# EAGLE design 89c2051-mac-ps2 (EAGLE 4.16)
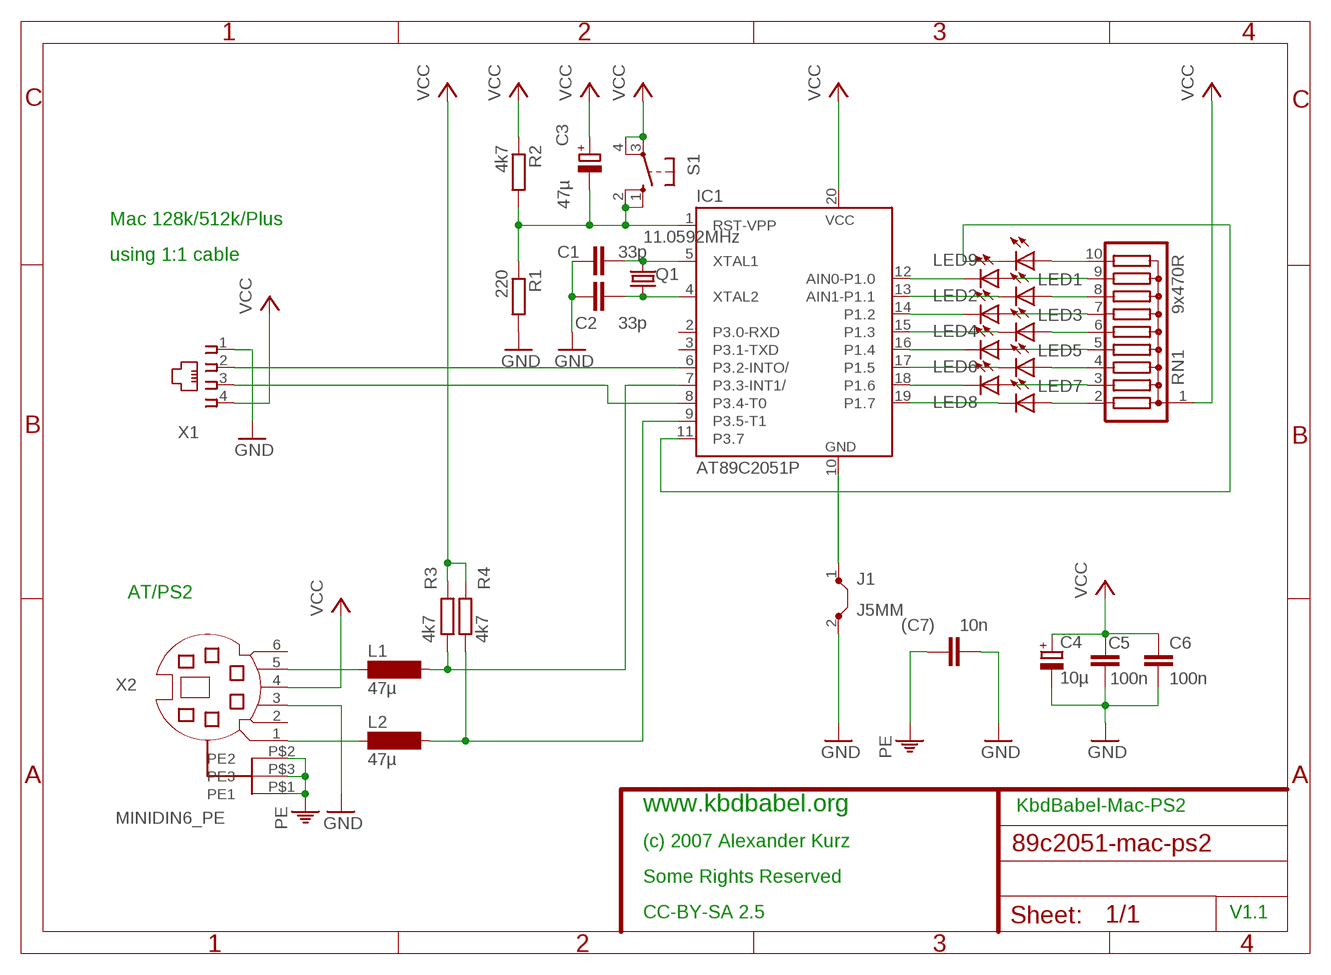
[diagram p0: schematic, sheet 1]

## Parts
(C7)  10n  C-EU025_050-025X075  [C025_050-025X075]
C1  33p  C-EU025-030X050  [C025-030X050]
C2  33p  C-EU025-030X050  [C025-030X050]
C3  47µ  CPOL-EUE2-5  [E2-5]
C4  10µ  CPOL-EUE2-5  [E2-5]
C5  100n  C-EU025_050-025X075  [C025_050-025X075]
C6  100n  C-EU025_050-025X075  [C025_050-025X075]
IC1  AT89C2051P  [DIL20]
J1  J5MM  [05]
L1  47µ  SD75  [SD75]
L2  47µ  SD75  [SD75]
LED1  LEDSQR2X5  [LED2X5]
LED2  LEDSQR2X5  [LED2X5]
LED3  LEDSQR2X5  [LED2X5]
LED4  LEDSQR2X5  [LED2X5]
LED5  LEDSQR2X5  [LED2X5]
LED6  LEDSQR2X5  [LED2X5]
LED7  LEDSQR2X5  [LED2X5]
LED8  LEDSQR2X5  [LED2X5]
LED9  LEDSQR2X5  [LED2X5]
Q1  11.0592MHz  CRYSTALHC49U70  [HC49U70]
R1  220  R-EU_0204/7  [0204/7]
R2  4k7  R-EU_0204/7  [0204/7]
R3  4k7  R-EU_0204/7  [0204/7]
R4  4k7  R-EU_0204/7  [0204/7]
RN1  9x470R  G09R  [SIL10]
S1  10-XX  [B3F-10XX]
X1  520249-2  [520249-2]
X2  MINIDIN6_PE  [MINIDIN6_PE]

## Nets
GND: (C7).2 C1.1 C2.2 C4.- C5.1 C6.2 J1.2 R1.2 X1.1 X2.3
N$1: C1.2 IC1.5(XTAL1) Q1.2
N$2: C2.1 IC1.4(XTAL2) Q1.1
N$3: IC1.10(GND) J1.1
N$4: LED4.A RN1.6
N$5: LED8.A RN1.2
N$6: L1.1 X2.5
N$7: IC1.6(P3.2-INTO/) X1.2
N$8: LED7.A RN1.3
N$9: C3.- IC1.1(RST-VPP) R1.1 R2.2 S1.1(S) S1.2(S1)
N$10: IC1.8(P3.4-T0) X1.3
N$11: LED6.A RN1.4
N$12: IC1.9(P3.5-T1) L2.2 R4.2
N$13: LED5.A RN1.5
N$14: LED3.A RN1.7
N$15: LED2.A RN1.8
N$16: LED1.A RN1.9
N$17: LED9.A RN1.10
N$18: IC1.12(AIN0-P1.0) LED1.K(C)
N$19: IC1.13(AIN1-P1.1) LED2.K(C)
N$20: IC1.14(P1.2) LED3.K(C)
N$21: IC1.15(P1.3) LED4.K(C)
N$22: IC1.16(P1.4) LED5.K(C)
N$23: IC1.17(P1.5) LED6.K(C)
N$24: IC1.18(P1.6) LED7.K(C)
N$25: IC1.19(P1.7) LED8.K(C)
N$26: L2.1 X2.1
N$28: IC1.11(P3.7) LED9.K(C)
N$30: IC1.7(P3.3-INT1/) L1.2 R3.2
PE: (C7).1 X2.P$1(PE1) X2.P$2(PE2) X2.P$3(PE3)
VCC: C3.+ C4.+ C5.2 C6.1 IC1.20(VCC) R2.1 R3.1 R4.1 RN1.1 S1.3(P) S1.4(P1) X1.4 X2.4
Unconnected: IC1.2(P3.0-RXD) IC1.3(P3.1-TXD) X2.2 X2.6

## Notes on the sheet
- Mac 128k/512k/Plus
- using 1:1 cable
- AT/PS2
- www.kbdbabel.org | KbdBabel-Mac-PS2
- (c) 2007 Alexander Kurz
- Some Rights Reserved
- CC-BY-SA 2.5 | V1.1

## Library data of the parts
(C7) C1 C2 C5 C6 = rcl:C-EU: CAPACITOR, European symbol
C3 C4 = rcl:CPOL-EU: POLARIZED CAPACITOR, European symbol
IC1 = atmel:AT89C2051: 80C31 MICROCONTROLLER 2 Kbytes FLASH 2.7 V
J1 = jumper:J: Bridge
L1 L2 = inductor-neosid:SD75: INDUCTOR nominal inductance, E12
LED1-LED9 = led:LED: LED OSRAM: - CHIPLED LG R971, LG N971, LY N971, LG Q971, LY Q971, LO R971, LY R971 LH N974, LH R974 LS Q976, LO Q976, LY Q976 LO Q996 - Hyper CHIPLED LW Q18S LB Q993, LB Q99A, LB R99A - SideLED LS A670, LO A670, LY A670, LG A670, LP A670 LB A673, LV A673, LT A673, LW A673 LH A674 LY A675 LS A676, LA A676, LO A676, LY A676, LW A676 LS A679, LY A679, LG A679 - Hyper Micro SIDELED® LS Y876, LA Y876, LO Y876, LY Y876 LT Y87S - SmartLED LW L88C, LW L88S LB L89C, LB L89S, LG L890 LS L89K, LO L89K, LY L89K LS L896, LA L896, LO L896, LY L896 - TOPLED LS T670, LO T670, LY T670, LG T670, LP T670 LSG T670, LSP T670, LSY T670, LOP T670, LYG T670 LG T671, LOG T671, LSG T671 LB T673, LV T673, LT T673, LW T673 LH T674 LS T676, LA T676, LO T676, LY T676, LB T676, LH T676, LSB T676, LW T676 LB T67C, LV T67C, LT T67C, LS T67K, LO T67K, LY T67K, LW E67C LS E67B, LA E67B, LO E67B, LY E67B, LB E67C, LV E67C, LT E67C LW T67C LS T679, LY T679, LG T679 LS T770, LO T770, LY T770, LG T770, LP T770 LB T773, LV T773, LT T773, LW T773 LH T774 LS E675, LA E675, LY E675, LS T675 LS T776, LA T776, LO T776, LY T776, LB T776 LHGB T686 LT T68C, LB T68C - Hyper Mini TOPLED® LB M676 - Mini TOPLED Santana® LG M470 LS M47K, LO M47K, LY M47K Source: http://www.osram.convergy.de - LUMILED® LXK2-PW12-R00, LXK2-PW12-S00, LXK2-PW14-U00, LXK2-PW14-V00 LXK2-PM12-R00, LXK2-PM12-S00, LXK2-PM14-U00 LXK2-PE12-Q00, LXK2-PE12-R00, LXK2-PE12-S00, LXK2-PE14-T00, LXK2-PE14-U00 LXK2-PB12-K00, LXK2-PB12-L00, LXK2-PB12-M00, LXK2-PB14-N00, LXK2-PB14-P00, LXK2-PB14-Q00 LXK2-PR12-L00, LXK2-PR12-M00, LXK2-PR14-Q00, LXK2-PR14-R00 LXK2-PD12-Q00, LXK2-PD12-R00, LXK2-PD12-S00 LXK2-PH12-R00, LXK2-PH12-S00 LXK2-PL12-P00, LXK2-PL12-Q00, LXK2-PL12-R00 Source: www.luxeon.com
Q1 = crystal:CRYSTAL: CRYSTAL
R1-R4 = rcl:R-EU_: RESISTOR, European symbol
RN1 = resistor-sil:G09R: SIL RESISTOR
S1 = switch-omron:10-XX: OMRON SWITCH
X1 = con-amp:520249-2: AMP connector
X2 = bla:MINIDIN6_PE

## Board
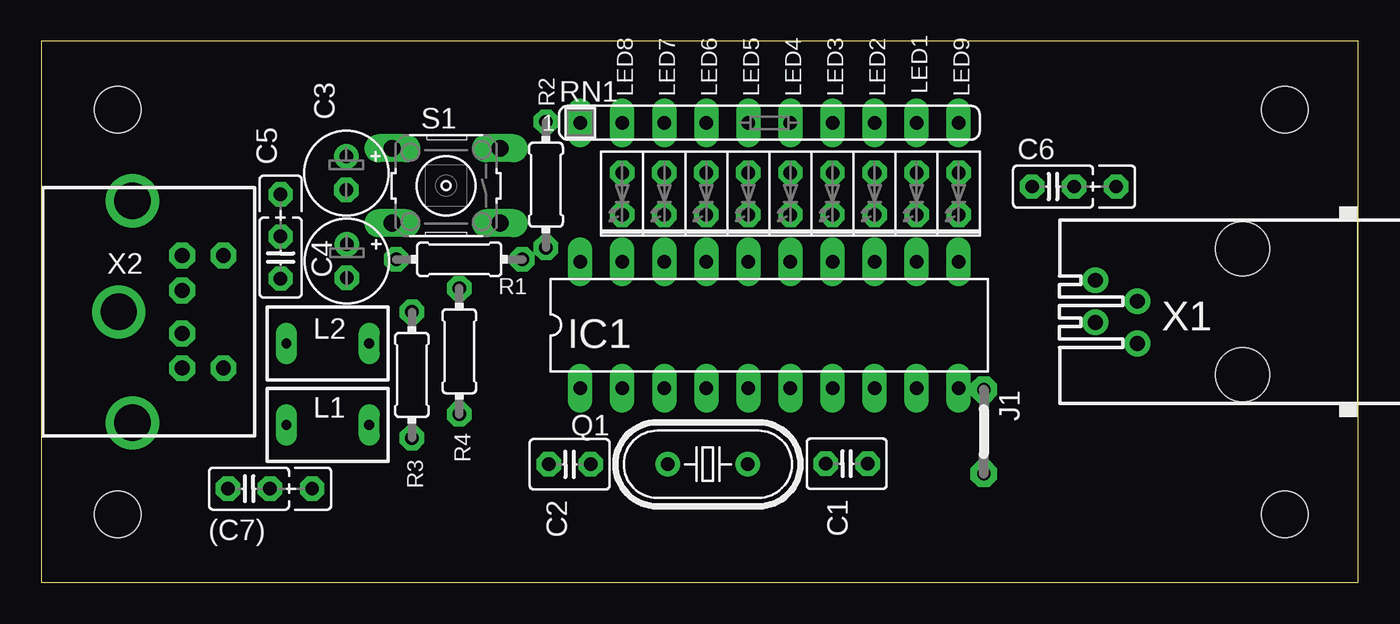
[diagram p1: board, top side]
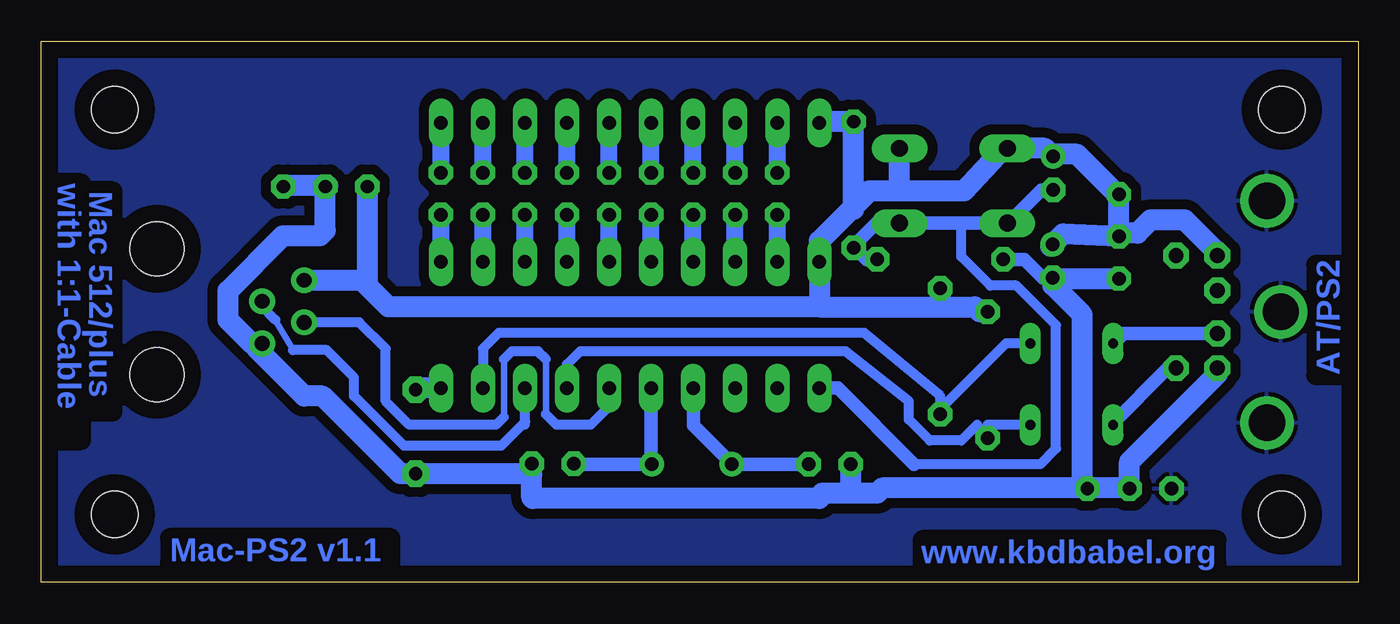
[diagram p2: board, bottom side, seen from below]

Size 79.52 x 32.69 mm. Coordinates in mm from the lower left corner, seen from the top.
Outline: 79.52,0 79.52,32.69 0,32.69 0,0 79.52,0
Copper layers (1*16): Top 0.035mm / dielectric 1.5mm / Bottom 0.035mm
Design rules "default": minimum track width 16mil, minimum drill 24mil, track to track 12mil, track to pad 12mil, pad to pad 16mil, via to via 16mil, smd to smd 16mil, copper to edge 40mil, drill to drill 8mil, minimum pad ring 13mil, minimum via ring 8mil, stop-mask expansion 4mil, vias tented up to drill 0mil, thermal gap 10mil
Holes 2.8 mm at 75.08,4.12 75.08,28.57 4.6,28.57 4.6,4.12

### Footprints (pad centres in the part's own frame; a part is rotated, then mirrored left to right if it is on the bottom)
C025_050-025X075 = drill 0.813 octagon: 1 -1.27,0; 2 1.27,0; 3 3.81,0
C025-030X050 = drill 0.813 octagon: 1 -1.27,0; 2 1.27,0
E2-5 = drill 0.813 pad 1.27 round: + -1.016,0 | drill 0.813 pad 1.27 octagon: - 1.016,0
DIL20 = drill 0.813 long: 1 -11.43,-3.81; 2 -8.89,-3.81; 3 -6.35,-3.81; 4 -3.81,-3.81; 5 -1.27,-3.81; 6 1.27,-3.81; 7 3.81,-3.81; 8 6.35,-3.81; 9 8.89,-3.81; 10 11.43,-3.81; 11 11.43,3.81; 12 8.89,3.81; 13 6.35,3.81; 14 3.81,3.81; 15 1.27,3.81; 16 -1.27,3.81; 17 -3.81,3.81; 18 -6.35,3.81; 19 -8.89,3.81; 20 -11.43,3.81
05 = drill 0.813 pad 1.6 octagon: 1 -2.54,0; 2 2.54,0
SD75 = drill 0.6 long: 1 -2.5,0; 2 2.5,0
LED2X5 = drill 0.813 octagon: A -1.27,0; K 1.27,0
HC49U70 = drill 0.813 round: 1 -2.413,0; 2 2.413,0
0204/7 = drill 0.813 octagon: 1 -3.81,0; 2 3.81,0
SIL10 = drill 0.813 long: 1 -11.43,0; 2 -8.89,0; 3 -6.35,0; 4 -3.81,0; 5 -1.27,0; 6 1.27,0; 7 3.81,0; 8 6.35,0; 9 8.89,0; 10 11.43,0
B3F-10XX = drill 1.016 long: 1 -3.251,2.261; 2 3.251,2.261; 3 -3.251,-2.261; 4 3.251,-2.261
520249-2 = drill 0.889 round: 1 -1.905,6.35; 2 -0.635,8.89; 3 0.635,6.35; 4 1.905,8.89 | hole 3.251: -3.81,0; 3.81,0
MINIDIN6_PE = drill 0.9 octagon: 1 1.3,2.15; 2 -1.3,2.15; 3 3.4,2.15; 4 -3.4,2.15; 5 3.4,4.65; 6 -3.4,4.65 | drill 2.2 round: P$1 0,-1.676; P$2 -6.706,-0.838; P$3 6.706,-0.838

### Placement (x,y rotation side)
(C7)  12.54,5.66 0 top
C1  48.64,7.17 180 top
C2  31.9,7.14 180 top
C3  18.41,24.73 270 top
C4  18.44,19.42 270 top
C5  14.45,19.63 90 top
C6  61.1,23.91 0 top
IC1  43.97,15.55 0 top
J1  56.92,9.11 270 top
L1  17.3,9.52 0 top
L2  17.3,14.44 0 top
LED1  52.86,23.49 270 top
LED2  50.32,23.49 270 top
LED3  47.78,23.49 270 top
LED4  45.24,23.49 270 top
LED5  42.7,23.49 270 top
LED6  40.16,23.49 270 top
LED7  37.62,23.49 270 top
LED8  35.08,23.49 270 top
LED9  55.4,23.49 270 top
Q1  40.25,7.14 0 top
R1  25.24,19.52 180 top
R2  30.47,24.03 270 top
R3  22.38,12.53 270 top
R4  25.24,13.96 270 top
RN1  43.97,27.78 0 top
S1  24.44,23.96 180 top
X1  72.54,16.34 90 top
X2  6.34,16.34 270 top

### Tracks (layer width: path | path; a pad name or v marks a point on that pad's centre or on a via)
GND
  Bottom 0.813: C4.- 19.04,18.4 20.16,19.52 21.58,19.52 R1.2
  Bottom 1.27: 32.38,5.38 32.38,5.31 32.3,5.31 32.54,5.07 49.84,5.07 49.91,5.14 49.91,6.5 | 32.38,5.38 32.38,5.39 | C6.2 62.38,23.81 | 64.92,23.96 62.38,23.96 62.38,23.81 | 62.38,23.81 62.37,23.82 C6.2 | 49.91,6.5 C1.1 | X1.1 66.83,14.44 68.26,15.87 68.26,17.61 64.92,20.95 62.7,20.95 62.38,21.27 62.38,23.81 | 62.28,23.91 62.22,23.96 | 62.28,23.91 C6.2 | 62.38,23.81 62.28,23.91 | 30.63,5.38 29.05,5.38 28.73,5.71 16.66,5.71 | 30.63,5.38 32.38,5.38 | 13.81,5.71 16.66,5.71 | 16.66,5.71 16.66,16.19 18.44,17.96 C4.- 18.42,18.4 18.41,18.41 18.36,18.36 C5.1 | X2.3 8.49,12.61 13.81,7.3 13.81,5.71 | 13.81,5.71 13.81,5.7 (C7).2 | 30.63,5.38 30.63,5.39 C2.2 | X1.1 66.51,14.12 63.65,11.26 62.54,11.26 57.84,6.57 J1.2 50.06,6.57 50,6.5 49.91,6.5 | X1.1
N$1
  Bottom 0.813: 42.7,7.14 42.67,7.17 | C1.2 47.33,7.17 47.3,7.14 42.7,7.14 | Q1.2 42.7,7.14 | 42.7,7.14 IC1.5
N$2
  Bottom 0.61: IC1.4 | 40.13,11.71 IC1.4
  Bottom 0.813: C2.1 | C2.1 Q1.1 37.78,7.14 40.13,9.49 40.13,11.71
N$3
  Bottom 1.27: 56.99,11.74 56.92,11.68 J1.1 | IC1.10 56.99,11.74 | 56.99,11.74
N$4
  Bottom 1.016: LED4.A | LED4.A RN1.6
N$5
  Bottom 1.016: LED8.A | LED8.A RN1.2
N$6
  Bottom 0.813: 14.92,9.52 | L1.1 14.92,9.52 | X2.5 11.49,12.94 14.92,9.52
N$7
  Bottom 0.406: 49.05,10.15 49.05,13.49 | 51.59,13.49 51.59,9.99
  Bottom 0.61: 49.05,10.15 48.41,9.52 46.35,9.52 45.24,10.63 IC1.6 | 49.05,13.49 49.52,13.96 51.11,13.96 51.59,13.49 | 51.59,9.99 52.06,9.52 57.3,9.52 58.73,10.95 58.73,14.12 60.32,15.71 X1.2 | X1.2
N$8
  Bottom 1.016: LED7.A RN1.3
N$9
  Bottom 0.61: 26.82,7.14 19.2,7.14 18.25,8.09 18.25,15.55 20.63,17.93 22.22,17.93 23.97,19.68 23.97,21.7
  Bottom 0.813: 21.19,21.66 21.27,21.58 | S1.2 21.19,21.66 | C3.- 19.14,23.71 21.19,21.66 | 27.74,21.7 S1.1 | 23.97,21.7 S1.2 | 23.97,21.7 27.74,21.7 | 27.74,21.7 27.78,21.74 | 30.57,20.22 30.63,20.15 | 30.57,20.22 R2.2 30.47,20.31 29.68,19.52 R1.1 | 27.74,21.7 29.08,21.7 30.57,20.22 | S1.2 21.23,21.7 21.27,21.74 21.31,21.7 23.97,21.7 | IC1.1 31.43,11.74 26.82,7.14
N$10
  Bottom 0.406: 64.33,14.03 65.4,15.87
  Bottom 0.61: X1.3 66.19,16.66 65.4,15.87 | 50.4,9.6 50.29,9.71 | 50.4,9.6 51.75,8.25 57.62,8.25 60.64,11.26 60.64,12.38 62.29,14.03 64.33,14.03 | 50.4,9.6 50.32,9.52 IC1.8 | 50.4,9.6
N$11
  Bottom 1.016: LED6.A | LED6.A RN1.4
N$12
  Bottom 0.61: L2.2 21.27,14.44 25.24,10.47 R4.2 25.24,11.26 29.84,15.07 51.91,15.07 52.86,14.12 IC1.9 | IC1.9
N$13
  Bottom 1.016: LED5.A RN1.5
N$14
  Bottom 1.016: LED3.A RN1.7
N$15
  Bottom 1.016: LED2.A RN1.8
N$16
  Bottom 1.016: LED1.A RN1.9
N$17
  Bottom 1.016: LED9.A RN1.10
N$18
  Bottom 1.016: IC1.12 LED1.K
N$19
  Bottom 1.016: IC1.13 LED2.K
N$20
  Bottom 1.016: IC1.14 LED3.K
N$21
  Bottom 1.016: IC1.15 LED4.K
N$22
  Bottom 1.016: IC1.16 LED5.K
N$23
  Bottom 1.016: LED6.K | IC1.17 LED6.K
N$24
  Bottom 1.016: IC1.18 LED7.K
N$25
  Bottom 1.016: IC1.19 LED8.K
N$26
  Bottom 0.813: 14.76,14.44 | 14.76,14.44 L2.1 | X2.1 14.15,15.04 14.76,14.44
N$28
  Bottom 1.016: IC1.11 LED9.K
N$30
  Bottom 0.61: 22.38,9.52 R3.2 23.01,9.52 23.97,8.57 25.87,8.57 27.14,9.84 27.14,10.95 30.95,13.96 46.98,13.96 47.78,13.17 47.78,11.9 47.94,11.74 | L1.2 22.38,9.52 | 22.38,9.52 | 47.94,11.74 | 47.94,11.74 IC1.7
PE
  pour Bottom (isolate 0.61): 79.67,-0.13 79.64,32.85 -0.18,32.85 -0.14,-0.1
VCC
  Bottom 1.27: X2.4 8.65,20.08 10.47,21.9 12.54,21.9 13.33,21.11 14.44,21.11 14.45,21.1 C5.2 | S1.4 21.15,26.23 21.11,26.19 | 18.41,25.71 | 18.41,25.71 C3.+ 18.41,25.87 | S1.4 18.92,26.23 18.41,25.71 | 18.41,25.87 | C4.+ 18.57,20.31 | C4.+ | C5.2 17.83,21.06 C4.+ | R3.1 22.85,16.34 23.15,16.64 25.24,16.64 | 25.24,16.64 25.24,16.82 | 25.24,16.82 R4.1 | 25.24,16.82 | 58.57,16.66 | 58.57,16.66 58.57,16.64 | 32.54,16.64 25.24,16.64 | 32.54,16.64 58.55,16.64 58.57,16.66 | IC1.20 32.54,16.64 | IC1.20 32.46,19.44 | X1.4 60.16,18.25 59.92,18.01 | 58.57,16.66 59.92,18.01 | 59.92,18.01 | C6.1 59.83,18.1 59.92,18.01 | S1.4 21.39,26.23 23.81,23.65 27.78,23.65 | 27.78,23.65 29.52,23.65 30.55,22.62 | 30.55,22.62 32.54,20.63 IC1.20 | IC1.20 | S1.3 27.69,23.73 27.78,23.65 | 30.55,22.62 30.47,22.54 R2.1 32.47,27.84 RN1.1 | 18.41,25.87 16.98,25.87 14.44,23.33 14.44,20.95 14.45,20.94 C5.2

### Text on the board
Bottom: Mac 512/plus | with 1:1-Cable | AT/PS2 | www.kbdbabel.org | Mac-PS2 v1.1